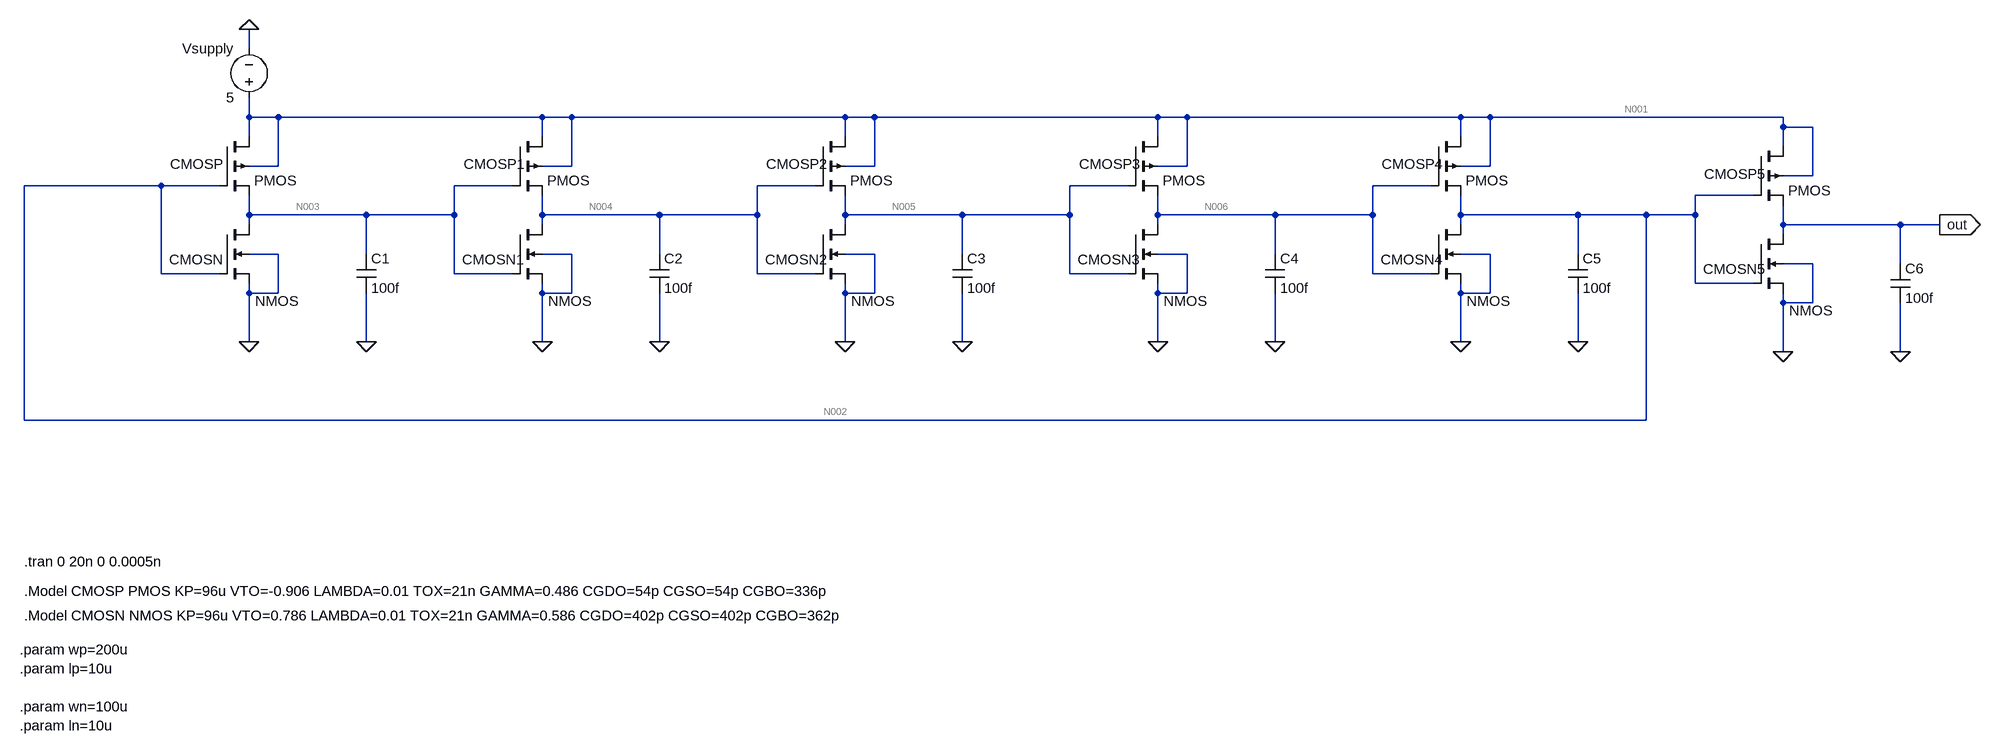
[diagram p0: schematic ringOsci.asc]
ringOsci.asc, the LTspice schematic file:
Version 4
SHEET 1 3776 1136
WIRE 384 -80 384 -112
WIRE 384 32 384 0
WIRE 432 32 384 32
WIRE 864 32 432 32
WIRE 912 32 864 32
WIRE 1360 32 912 32
WIRE 1408 32 1360 32
WIRE 1872 32 1408 32
WIRE 1920 32 1872 32
WIRE 2368 32 1920 32
WIRE 2416 32 2368 32
WIRE 2896 32 2416 32
WIRE 2896 48 2896 32
WIRE 2944 48 2896 48
WIRE 384 64 384 32
WIRE 864 64 864 32
WIRE 1360 64 1360 32
WIRE 1872 64 1872 32
WIRE 2368 64 2368 32
WIRE 2896 80 2896 48
WIRE 432 112 432 32
WIRE 432 112 384 112
WIRE 912 112 912 32
WIRE 912 112 864 112
WIRE 1408 112 1408 32
WIRE 1408 112 1360 112
WIRE 1920 112 1920 32
WIRE 1920 112 1872 112
WIRE 2416 112 2416 32
WIRE 2416 112 2368 112
WIRE 2944 128 2944 48
WIRE 2944 128 2896 128
WIRE 240 144 16 144
WIRE 336 144 240 144
WIRE 816 144 720 144
WIRE 1312 144 1216 144
WIRE 1824 144 1728 144
WIRE 2320 144 2224 144
WIRE 2848 160 2752 160
WIRE 384 192 384 160
WIRE 576 192 384 192
WIRE 720 192 720 144
WIRE 720 192 576 192
WIRE 864 192 864 160
WIRE 1056 192 864 192
WIRE 1216 192 1216 144
WIRE 1216 192 1056 192
WIRE 1360 192 1360 160
WIRE 1552 192 1360 192
WIRE 1728 192 1728 144
WIRE 1728 192 1552 192
WIRE 1872 192 1872 160
WIRE 2064 192 1872 192
WIRE 2224 192 2224 144
WIRE 2224 192 2064 192
WIRE 2368 192 2368 160
WIRE 2560 192 2368 192
WIRE 2672 192 2560 192
WIRE 2752 192 2752 160
WIRE 2752 192 2672 192
WIRE 384 208 384 192
WIRE 864 208 864 192
WIRE 1360 208 1360 192
WIRE 1872 208 1872 192
WIRE 2368 208 2368 192
WIRE 2896 208 2896 176
WIRE 3088 208 2896 208
WIRE 3152 208 3088 208
WIRE 2896 224 2896 208
WIRE 432 256 384 256
WIRE 576 256 576 192
WIRE 912 256 864 256
WIRE 1056 256 1056 192
WIRE 1408 256 1360 256
WIRE 1552 256 1552 192
WIRE 1920 256 1872 256
WIRE 2064 256 2064 192
WIRE 2416 256 2368 256
WIRE 2560 256 2560 192
WIRE 2944 272 2896 272
WIRE 3088 272 3088 208
WIRE 240 288 240 144
WIRE 336 288 240 288
WIRE 720 288 720 192
WIRE 816 288 720 288
WIRE 1216 288 1216 192
WIRE 1312 288 1216 288
WIRE 1728 288 1728 192
WIRE 1824 288 1728 288
WIRE 2224 288 2224 192
WIRE 2320 288 2224 288
WIRE 2752 304 2752 192
WIRE 2848 304 2752 304
WIRE 384 320 384 304
WIRE 432 320 432 256
WIRE 432 320 384 320
WIRE 864 320 864 304
WIRE 912 320 912 256
WIRE 912 320 864 320
WIRE 1360 320 1360 304
WIRE 1408 320 1408 256
WIRE 1408 320 1360 320
WIRE 1872 320 1872 304
WIRE 1920 320 1920 256
WIRE 1920 320 1872 320
WIRE 2368 320 2368 304
WIRE 2416 320 2416 256
WIRE 2416 320 2368 320
WIRE 2896 336 2896 320
WIRE 2944 336 2944 272
WIRE 2944 336 2896 336
WIRE 384 400 384 320
WIRE 576 400 576 320
WIRE 864 400 864 320
WIRE 1056 400 1056 320
WIRE 1360 400 1360 320
WIRE 1552 400 1552 320
WIRE 1872 400 1872 320
WIRE 2064 400 2064 320
WIRE 2368 400 2368 320
WIRE 2560 400 2560 320
WIRE 2896 416 2896 336
WIRE 3088 416 3088 336
WIRE 16 528 16 144
WIRE 2672 528 2672 192
WIRE 2672 528 16 528
FLAG 384 400 0
FLAG 384 -112 0
FLAG 576 400 0
FLAG 864 400 0
FLAG 1056 400 0
FLAG 1360 400 0
FLAG 1552 400 0
FLAG 1872 400 0
FLAG 2064 400 0
FLAG 2368 400 0
FLAG 2560 400 0
FLAG 2896 416 0
FLAG 3088 416 0
FLAG 3152 208 out
IOPIN 3152 208 Out
SYMBOL pmos4 336 64 R0
WINDOW 0 -81 45 Left 2
SYMATTR InstName CMOSP
SYMATTR Value2 l={Lp} w={Wp}
SYMBOL nmos4 336 208 R0
WINDOW 0 -83 57 Left 2
WINDOW 3 58 125 Left 2
SYMATTR InstName CMOSN
SYMATTR Value2 l={Ln} w={Wn}
SYMBOL voltage 384 16 R180
WINDOW 0 24 96 Left 2
WINDOW 3 24 16 Left 2
WINDOW 123 0 0 Left 0
WINDOW 39 0 0 Left 0
SYMATTR InstName Vsupply
SYMATTR Value 5
SYMBOL cap 560 256 R0
SYMATTR InstName C1
SYMATTR Value 100f
SYMBOL pmos4 816 64 R0
WINDOW 0 -81 45 Left 2
SYMATTR InstName CMOSP1
SYMATTR Value2 l={Lp} w={Wp}
SYMBOL nmos4 816 208 R0
WINDOW 0 -83 57 Left 2
WINDOW 3 58 125 Left 2
SYMATTR InstName CMOSN1
SYMATTR Value2 l={Ln} w={Wn}
SYMBOL cap 1040 256 R0
SYMATTR InstName C2
SYMATTR Value 100f
SYMBOL pmos4 1312 64 R0
WINDOW 0 -81 45 Left 2
SYMATTR InstName CMOSP2
SYMATTR Value2 l={Lp} w={Wp}
SYMBOL nmos4 1312 208 R0
WINDOW 0 -83 57 Left 2
WINDOW 3 58 125 Left 2
SYMATTR InstName CMOSN2
SYMATTR Value2 l={Ln} w={Wn}
SYMBOL cap 1536 256 R0
SYMATTR InstName C3
SYMATTR Value 100f
SYMBOL pmos4 1824 64 R0
WINDOW 0 -81 45 Left 2
SYMATTR InstName CMOSP3
SYMATTR Value2 l={Lp} w={Wp}
SYMBOL nmos4 1824 208 R0
WINDOW 0 -83 57 Left 2
WINDOW 3 58 125 Left 2
SYMATTR InstName CMOSN3
SYMATTR Value2 l={Ln} w={Wn}
SYMBOL cap 2048 256 R0
SYMATTR InstName C4
SYMATTR Value 100f
SYMBOL pmos4 2320 64 R0
WINDOW 0 -81 45 Left 2
SYMATTR InstName CMOSP4
SYMATTR Value2 l={Lp} w={Wp}
SYMBOL nmos4 2320 208 R0
WINDOW 0 -83 57 Left 2
WINDOW 3 58 125 Left 2
SYMATTR InstName CMOSN4
SYMATTR Value2 l={Ln} w={Wn}
SYMBOL cap 2544 256 R0
SYMATTR InstName C5
SYMATTR Value 100f
SYMBOL pmos4 2848 80 R0
WINDOW 0 -81 45 Left 2
SYMATTR InstName CMOSP5
SYMATTR Value2 l={Lp} w={Wp}
SYMBOL nmos4 2848 224 R0
WINDOW 0 -83 57 Left 2
WINDOW 3 58 125 Left 2
SYMATTR InstName CMOSN5
SYMATTR Value2 l={Ln} w={Wn}
SYMBOL cap 3072 272 R0
SYMATTR InstName C6
SYMATTR Value 100f
TEXT 16 760 Left 2 !.tran 0 20n 0 0.0005n
TEXT 16 848 Left 2 !.Model CMOSN NMOS KP=96u VTO=0.786 LAMBDA=0.01 TOX=21n GAMMA=0.586 CGDO=402p CGSO=402p CGBO=362p
TEXT 16 808 Left 2 !.Model CMOSP PMOS KP=96u VTO=-0.906 LAMBDA=0.01 TOX=21n GAMMA=0.486 CGDO=54p CGSO=54p CGBO=336p
TEXT 8 904 Left 2 !.param wp=200u\n.param lp=10u\n \n.param wn=100u\n.param ln=10u

The netlist it stands for:
* ringOsci.asc
M§CMOSP N001 N002 N003 N001 PMOS l={Lp} w={Wp}
M§CMOSN N003 N002 0 0 NMOS l={Ln} w={Wn}
Vsupply N001 0 5
C1 N003 0 100f
M§CMOSP1 N001 N003 N004 N001 PMOS l={Lp} w={Wp}
M§CMOSN1 N004 N003 0 0 NMOS l={Ln} w={Wn}
C2 N004 0 100f
M§CMOSP2 N001 N004 N005 N001 PMOS l={Lp} w={Wp}
M§CMOSN2 N005 N004 0 0 NMOS l={Ln} w={Wn}
C3 N005 0 100f
M§CMOSP3 N001 N005 N006 N001 PMOS l={Lp} w={Wp}
M§CMOSN3 N006 N005 0 0 NMOS l={Ln} w={Wn}
C4 N006 0 100f
M§CMOSP4 N001 N006 N002 N001 PMOS l={Lp} w={Wp}
M§CMOSN4 N002 N006 0 0 NMOS l={Ln} w={Wn}
C5 N002 0 100f
M§CMOSP5 N001 N002 out N001 PMOS l={Lp} w={Wp}
M§CMOSN5 out N002 0 0 NMOS l={Ln} w={Wn}
C6 out 0 100f
.model NMOS NMOS
.model PMOS PMOS
.lib standard.mos
.tran 0 20n 0 0.0005n
.Model CMOSN NMOS KP=96u VTO=0.786 LAMBDA=0.01 TOX=21n GAMMA=0.586 CGDO=402p CGSO=402p CGBO=362p
.Model CMOSP PMOS KP=96u VTO=-0.906 LAMBDA=0.01 TOX=21n GAMMA=0.486 CGDO=54p CGSO=54p CGBO=336p
.param wp=200u
.param lp=10u
.param wn=100u
.param ln=10u
.backanno
.end

* Results of the author's LTspice run, read from the files saved beside the schematic
* Operating Point, zero values left out:
*   V(n001) = 5 V
*   V(n002) = 2.929 V
*   V(n003) = 2.929 V
*   V(n004) = 2.929 V
*   V(n005) = 2.929 V
*   V(n006) = 2.929 V
*   V(out) = 2.929 V
*   Id(Cmosp) = 857.9 µA
*   Ib(Cmosp) = 2.081 pA
*   Is(Cmosp) = -857.9 µA
*   Id(Cmosp1) = 857.9 µA
*   Ib(Cmosp1) = 2.081 pA
*   Is(Cmosp1) = -857.9 µA
*   Id(Cmosp2) = 857.9 µA
*   Ib(Cmosp2) = 2.081 pA
*   Is(Cmosp2) = -857.9 µA
*   Id(Cmosp3) = 857.9 µA
*   Ib(Cmosp3) = 2.081 pA
*   Is(Cmosp3) = -857.9 µA
*   Id(Cmosp4) = 857.9 µA
*   Ib(Cmosp4) = 2.081 pA
*   Is(Cmosp4) = -857.9 µA
*   Id(Cmosp5) = 857.9 µA
*   Ib(Cmosp5) = 2.081 pA
*   Is(Cmosp5) = -857.9 µA
*   Id(Cmosn) = 857.9 µA
*   Ib(Cmosn) = -2.939 pA
*   Is(Cmosn) = -857.9 µA
*   Id(Cmosn1) = 857.9 µA
*   Ib(Cmosn1) = -2.939 pA
*   Is(Cmosn1) = -857.9 µA
*   Id(Cmosn2) = 857.9 µA
*   Ib(Cmosn2) = -2.939 pA
*   Is(Cmosn2) = -857.9 µA
*   Id(Cmosn3) = 857.9 µA
*   Ib(Cmosn3) = -2.939 pA
*   Is(Cmosn3) = -857.9 µA
*   Id(Cmosn4) = 857.9 µA
*   Ib(Cmosn4) = -2.939 pA
*   Is(Cmosn4) = -857.9 µA
*   Id(Cmosn5) = 857.9 µA
*   Ib(Cmosn5) = -2.939 pA
*   Is(Cmosn5) = -857.9 µA
*   I(Vsupply) = -5.147 mA
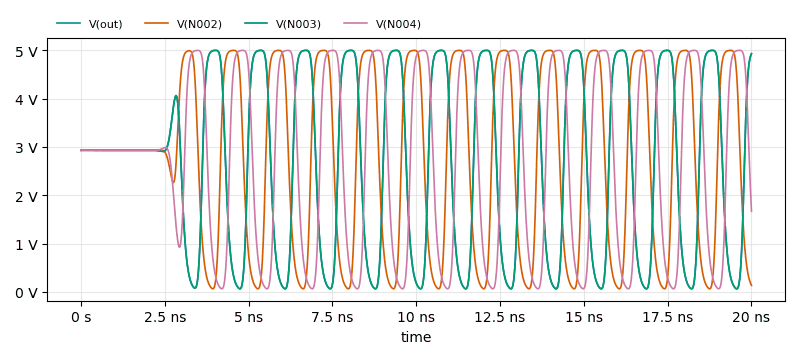
[diagram p1: Transient Analysis of ringOsci.asc, plotted from the saved traces]
* Transient Analysis, 1 run:
*   V(out): min 62.47 mV, max 4.997 V, average 2.682 V, rms 3.264 V, last 4.928 V
*   V(N002): min 62.47 mV, max 4.997 V, average 2.733 V, rms 3.305 V, last 134.7 mV
*   V(N003): min 62.47 mV, max 4.997 V, average 2.682 V, rms 3.264 V, last 4.928 V
*   V(N004): min 62.47 mV, max 4.997 V, average 2.749 V, rms 3.315 V, last 1.666 V